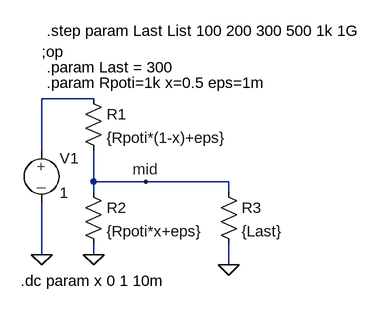
[diagram p0: schematic poti_belastet.asc]
poti_belastet.asc, the LTspice schematic file:
Version 4
SHEET 1 880 680
WIRE 144 64 64 64
WIRE 64 144 64 64
WIRE 144 192 144 144
WIRE 224 192 144 192
WIRE 352 192 224 192
WIRE 144 208 144 192
WIRE 352 208 352 192
WIRE 64 304 64 224
WIRE 144 304 144 288
WIRE 352 320 352 288
FLAG 64 304 0
FLAG 144 304 0
FLAG 224 192 mid
FLAG 352 320 0
SYMBOL res 128 48 R0
SYMATTR InstName R1
SYMATTR Value {Rpoti*(1-x)+eps}
SYMBOL res 128 192 R0
SYMATTR InstName R2
SYMATTR Value {Rpoti*x+eps}
SYMBOL source-V 64 128 R0
SYMATTR InstName V1
SYMATTR Value 1
SYMBOL res 336 192 R0
SYMATTR InstName R3
SYMATTR Value {Last}
TEXT 72 40 Left 2 !.param Rpoti=1k x=0.5 eps=1m
TEXT 64 -8 Left 2 !;op
TEXT 32 344 Left 2 !.dc param x 0 1 10m
TEXT 72 16 Left 2 !.param Last = 300
TEXT 72 -40 Left 2 !.step param Last List 100 200 300 500 1k 1G

The netlist it stands for:
* poti_belastet.asc
R1 N001 mid {Rpoti*(1-x)+eps}
R2 mid 0 {Rpoti*x+eps}
V1 N001 0 1
R3 mid 0 {Last}
.param Rpoti=1k x=0.5 eps=1m
;op
.dc param x 0 1 10m
.param Last = 300
.step param Last List 100 200 300 500 1k 1G
.backanno
.end